# Altium schematic sheet Sheet1.SchDoc
size A4; SheetNumber: 1; SheetTotal: 1
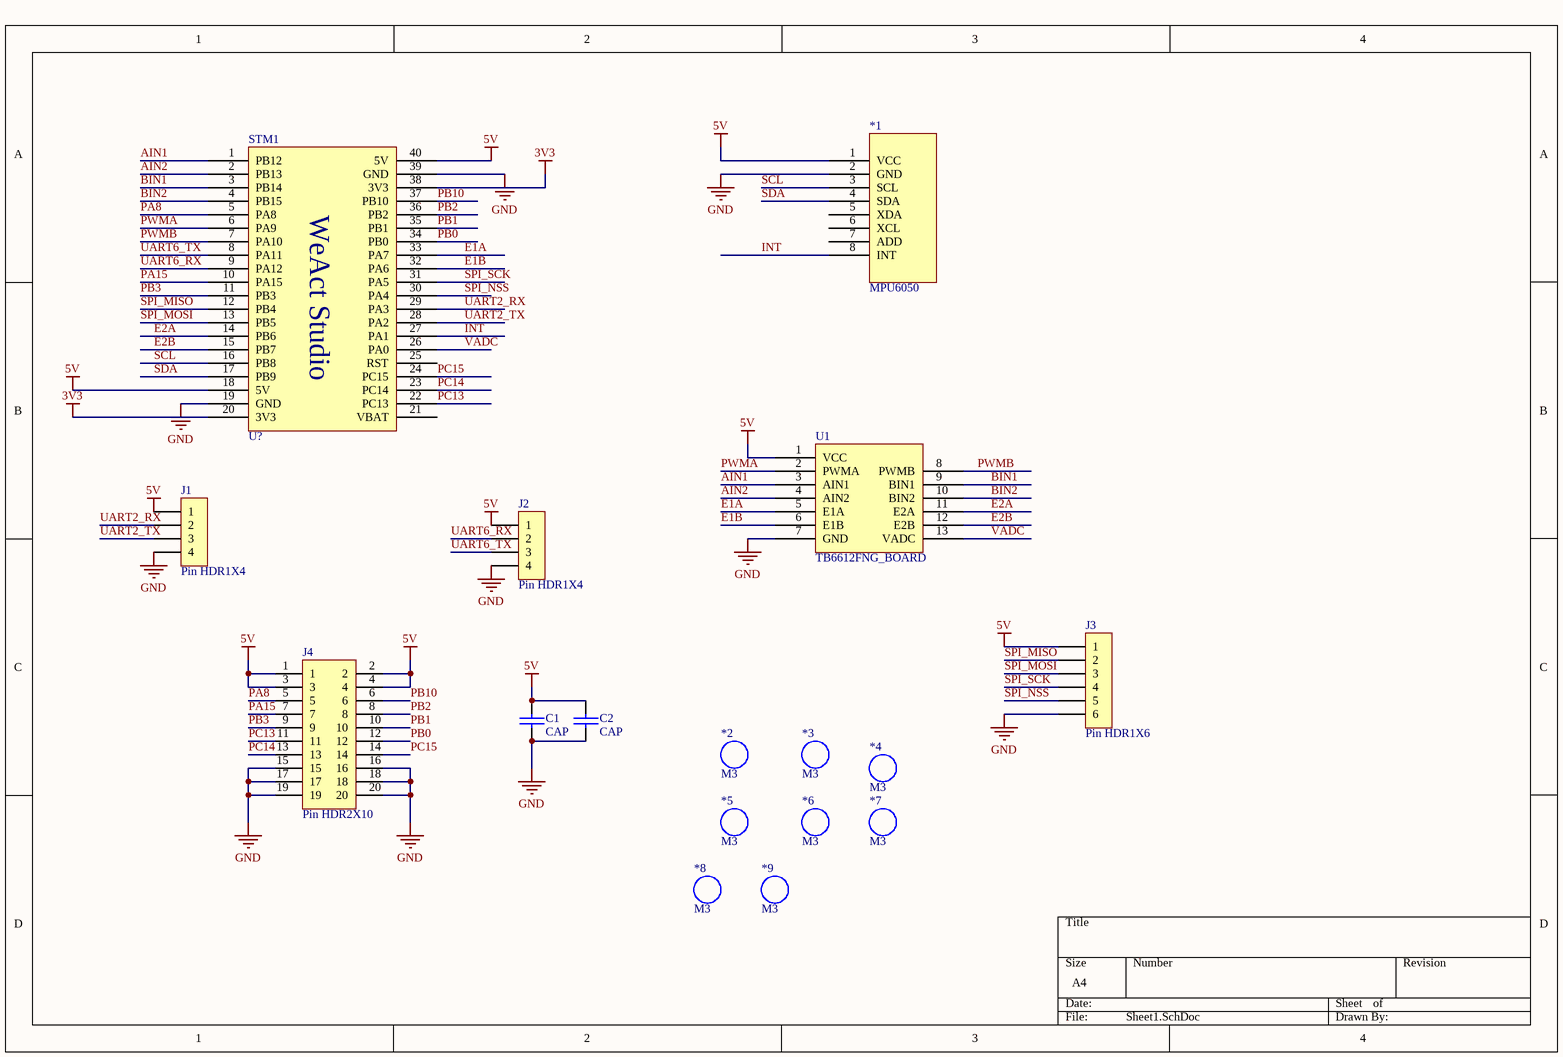
[diagram p0: Sheet1.SchDoc]

## Parts
*1  MPU6050  [MPU6050]
*2  M3  [M3 125X300]
*3  M3  [M3 125X300]
*4  M3  [M3 125X300]
*5  M3  [M3 125X300]
*6  M3  [M3 125X300]
*7  M3  [M3 125X300]
*8  M3  [M3 125X300]
*9  M3  [M3 125X300]
C1  CAP  [RAD-0.2]
C2  CAP  [RAD-0.2]
J1  Pin HDR1X4  [Pin HDR1X4/2.54mm-S]
J2  Pin HDR1X4  [Pin HDR1X4/2.54mm-S]
J3  Pin HDR1X6  [Pin HDR1X6/2.54mm-S]
J4  Pin HDR2X10  [Pin HDR2X10/2.54mm-S]
STM1  U?  [STM32F4x1CxU6 WeActStudio]
U1  TB6612FNG_BOARD  [TB6612FNG_BOARD]

## Nets
3V3: STM1.20(3V3) STM1.38(3V3)
5V: *1.1(VCC) C1.2 C2.2 J1.1 J2.1 J3.1 J4.1 J4.2 J4.3 J4.4 STM1.18(5V) STM1.40(5V) U1.1(VCC)
GND: *1.2(GND) C1.1 C2.1 J1.4 J2.4 J3.6 J4.15 J4.16 J4.17 J4.18 J4.19 J4.20 STM1.19(GND) STM1.39(GND) U1.7(GND)
AIN1: STM1.1(PB12) U1.3(AIN1)
AIN2: STM1.2(PB13) U1.4(AIN2)
BIN1: STM1.3(PB14) U1.9(BIN1)
BIN2: STM1.4(PB15) U1.10(BIN2)
E1A: STM1.33(PA7) U1.5(E1A)
E1B: STM1.32(PA6) U1.6(E1B)
E2A: STM1.14(PB6) U1.11(E2A)
E2B: STM1.15(PB7) U1.12(E2B)
INT: *1.8(INT) STM1.27(PA1)
PA8: J4.5 STM1.5(PA8)
PA15: J4.7 STM1.10(PA15)
PB0: J4.12 STM1.34(PB0)
PB1: J4.10 STM1.35(PB1)
PB2: J4.8 STM1.36(PB2)
PB3: J4.9 STM1.11(PB3)
PB10: J4.6 STM1.37(PB10)
PC13: J4.11 STM1.22(PC13)
PC14: J4.13 STM1.23(PC14)
PC15: J4.14 STM1.24(PC15)
PWMA: STM1.6(PA9) U1.2(PWMA)
PWMB: STM1.7(PA10) U1.8(PWMB)
SCL: *1.3(SCL) STM1.16(PB8)
SDA: *1.4(SDA) STM1.17(PB9)
SPI_MISO: J3.2 STM1.12(PB4)
SPI_MOSI: J3.3 STM1.13(PB5)
SPI_NSS: J3.5 STM1.30(PA4)
SPI_SCK: J3.4 STM1.31(PA5)
UART2_RX: J1.2 STM1.29(PA3)
UART2_TX: J1.3 STM1.28(PA2)
UART6_RX: J2.2 STM1.9(PA12)
UART6_TX: J2.3 STM1.8(PA11)
VADC: STM1.26(PA0) U1.13(VADC)

Not connected (* = marked no-connect by the designer): *1 5(XDA) 6(XCL) 7(ADD); STM1 21(VBAT) 25(RST)

## Library data of the parts
*2-*9 = M3: 铜柱孔; 版权归属: 封装库来自淘宝 ID：黄晶宝石; BOM名称: 铜柱孔; 学习资源: https://shop463601444.taobao.com
C1 C2 = CAP: 无极性电容
STM1 = STM32F4x1CxU6 WeActStudio: STM32F4x1CxU6; ComponentLink1Description: WeAct Studio; ComponentLink1URL: WeAct-TC.cn; ComponentLink2Description: MiniF4-STM32F4x1 Github; ComponentLink2URL: https://github.com/WeActTC/MiniF4-STM32F4x1; ComponentLink3Description: MiniF4-STM32F4x1 Gitee; ComponentLink3URL: https://gitee.com/WeAct-TC/MiniF4-STM32F4x1
U1 = TB6612FNG_BOARD: tb6612电机驱动器，包含编码器